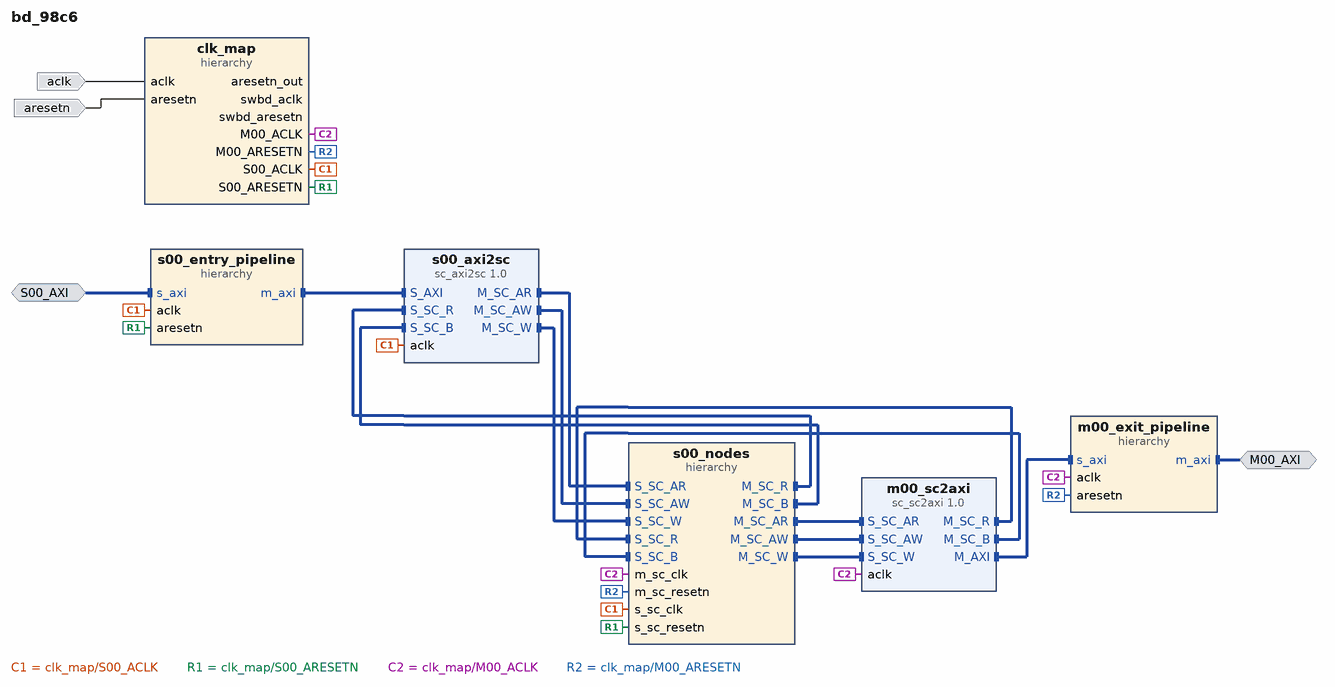
[diagram p0: block diagram of the top level]
# Vivado block design bd_98c6, xc7z020clg484-1, Vivado 2018.2
create_bd_design bd_98c6

create_bd_intf_port -mode Slave -vlnv xilinx.com:interface:aximm_rtl:1.0 S00_AXI
create_bd_intf_port -mode Master -vlnv xilinx.com:interface:aximm_rtl:1.0 M00_AXI
set_property -dict [list \
  CONFIG.SUPPORTS_NARROW_BURST 0 \
  CONFIG.MAX_BURST_LENGTH 16 \
  CONFIG.RUSER_BITS_PER_BYTE 0 \
  CONFIG.WUSER_BITS_PER_BYTE 0 \
] [get_bd_intf_ports M00_AXI]
create_bd_port -dir I -type clk aclk
set_property -dict {CONFIG.ASSOCIATED_BUSIF M00_AXI:S00_AXI} [get_bd_ports aclk]
create_bd_port -dir I -type rst aresetn
set_property -dict {CONFIG.POLARITY ACTIVE_LOW} [get_bd_ports aresetn]

create_bd_cell -type hier clk_map
create_bd_cell -type hier s00_entry_pipeline
create_bd_cell -type ip -vlnv xilinx.com:ip:sc_axi2sc:1.0 s00_axi2sc
set_property -dict [list \
  CONFIG.READ_WRITE_MODE READ_WRITE \
  CONFIG.AXI_ADDR_WIDTH 32 \
  CONFIG.AXI_ID_WIDTH 1 \
  CONFIG.AXI_RDATA_WIDTH 32 \
  CONFIG.AXI_WDATA_WIDTH 32 \
  CONFIG.SC_ADDR_WIDTH 32 \
  CONFIG.SC_ID_WIDTH 1 \
  CONFIG.SC_RDATA_WIDTH 64 \
  CONFIG.SC_WDATA_WIDTH 64 \
  CONFIG.SC_ARUSER_WIDTH 0 \
  CONFIG.SC_AWUSER_WIDTH 0 \
  CONFIG.SC_BUSER_WIDTH 0 \
  CONFIG.SC_WUSER_BITS_PER_BYTE 0 \
  CONFIG.SC_RUSER_BITS_PER_BYTE 0 \
  CONFIG.MSC_ROUTE_WIDTH 1 \
  CONFIG.SSC_ROUTE_WIDTH 1 \
] [get_bd_cells s00_axi2sc]
create_bd_cell -type hier s00_nodes
create_bd_cell -type ip -vlnv xilinx.com:ip:sc_sc2axi:1.0 m00_sc2axi
set_property -dict [list \
  CONFIG.READ_WRITE_MODE READ_WRITE \
  CONFIG.AXI_ADDR_WIDTH 32 \
  CONFIG.AXI_ID_WIDTH 1 \
  CONFIG.AXI_RDATA_WIDTH 64 \
  CONFIG.AXI_WDATA_WIDTH 64 \
  CONFIG.SC_ADDR_WIDTH 32 \
  CONFIG.SC_ID_WIDTH 1 \
  CONFIG.SC_RDATA_WIDTH 64 \
  CONFIG.SC_WDATA_WIDTH 64 \
  CONFIG.SC_ARUSER_WIDTH 0 \
  CONFIG.SC_AWUSER_WIDTH 0 \
  CONFIG.SC_BUSER_WIDTH 0 \
  CONFIG.SC_WUSER_BITS_PER_BYTE 0 \
  CONFIG.SC_RUSER_BITS_PER_BYTE 0 \
  CONFIG.MSC_ROUTE_WIDTH 1 \
  CONFIG.SSC_ROUTE_WIDTH 1 \
] [get_bd_cells m00_sc2axi]
create_bd_cell -type hier m00_exit_pipeline

# ---- hierarchy /clk_map ----
current_bd_instance /clk_map
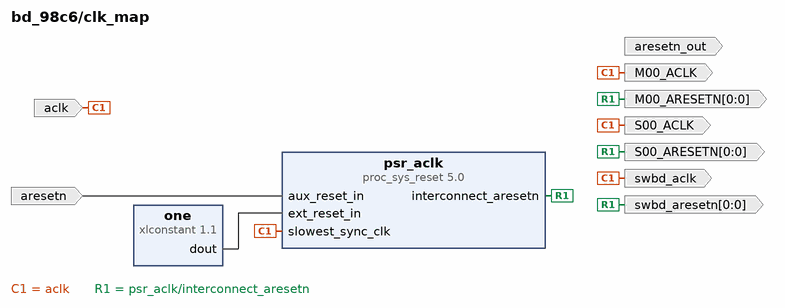
[diagram p1: block diagram inside /clk_map]
create_bd_pin -dir O -type clk S00_ACLK
create_bd_pin -dir O -from 0 -to 0 -type rst S00_ARESETN
create_bd_pin -dir O -type clk M00_ACLK
create_bd_pin -dir O -from 0 -to 0 -type rst M00_ARESETN
create_bd_pin -dir O -type clk swbd_aclk
create_bd_pin -dir O -from 0 -to 0 -type rst swbd_aresetn
create_bd_pin -dir I -type rst aresetn
create_bd_pin -dir O -type rst aresetn_out
create_bd_pin -dir I -type clk aclk

create_bd_cell -type ip -vlnv xilinx.com:ip:xlconstant:1.1 one
create_bd_cell -type ip -vlnv xilinx.com:ip:proc_sys_reset:5.0 psr_aclk
set_property -dict {CONFIG.C_AUX_RESET_HIGH 0 CONFIG.C_AUX_RST_WIDTH 1} [get_bd_cells psr_aclk]

# ---- hierarchy /s00_entry_pipeline ----
current_bd_instance /s00_entry_pipeline
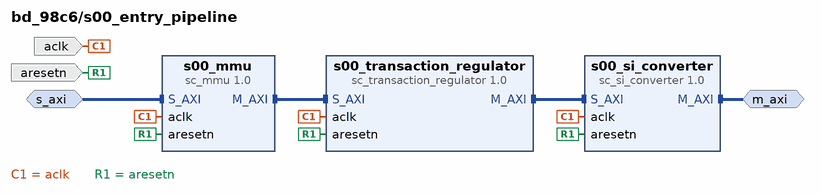
[diagram p2: block diagram inside /s00_entry_pipeline]
create_bd_intf_pin -mode Slave -vlnv xilinx.com:interface:aximm_rtl:1.0 s_axi
create_bd_intf_pin -mode Master -vlnv xilinx.com:interface:aximm_rtl:1.0 m_axi
create_bd_pin -dir I -type clk aclk
create_bd_pin -dir I -type rst aresetn

create_bd_cell -type ip -vlnv xilinx.com:ip:sc_mmu:1.0 s00_mmu
set_property -dict [list \
  CONFIG.IS_CASCADED 0 \
  CONFIG.NUM_SEG 1 \
  CONFIG.MSC_ROUTE_WIDTH 1 \
  CONFIG.NUM_MSC 1 \
  CONFIG.ADDR_WIDTH 32 \
  CONFIG.ID_WIDTH 1 \
  CONFIG.RDATA_WIDTH 32 \
  CONFIG.WDATA_WIDTH 32 \
  CONFIG.S_ARUSER_WIDTH 0 \
  CONFIG.S_AWUSER_WIDTH 0 \
  CONFIG.S_RUSER_WIDTH 0 \
  CONFIG.S_WUSER_WIDTH 0 \
  CONFIG.S_BUSER_WIDTH 0 \
  CONFIG.S_PROTOCOL AXI4 \
  CONFIG.READ_WRITE_MODE READ_WRITE \
  CONFIG.SEG000_BASE_ADDR 0x0000000000000000 \
  CONFIG.SEG000_SIZE 29 \
  CONFIG.SEG000_SEP_ROUTE 0b0000000000000000000000000000000000000000000000000000000000000000 \
  CONFIG.SEG000_SUPPORTS_READ 1 \
  CONFIG.SEG000_SUPPORTS_WRITE 1 \
  CONFIG.SEG000_SECURE_READ 0 \
  CONFIG.SEG000_SECURE_WRITE 0 \
  CONFIG.MSC000_ROUTE 0b1 \
] [get_bd_cells s00_mmu]
create_bd_cell -type ip -vlnv xilinx.com:ip:sc_transaction_regulator:1.0 s00_transaction_regulator
set_property -dict [list \
  CONFIG.READ_WRITE_MODE READ_WRITE \
  CONFIG.IS_CASCADED 0 \
  CONFIG.MEP_IDENTIFIER 0 \
  CONFIG.MEP_IDENTIFIER_WIDTH 1 \
  CONFIG.ADDR_WIDTH 32 \
  CONFIG.S_ID_WIDTH 1 \
  CONFIG.WDATA_WIDTH 32 \
  CONFIG.RDATA_WIDTH 32 \
  CONFIG.SEP_ROUTE_WIDTH 1 \
  CONFIG.SUPPORTS_READ_DEADLOCK 0 \
  CONFIG.SUPPORTS_WRITE_DEADLOCK 0 \
] [get_bd_cells s00_transaction_regulator]
create_bd_cell -type ip -vlnv xilinx.com:ip:sc_si_converter:1.0 s00_si_converter
set_property -dict [list \
  CONFIG.READ_WRITE_MODE READ_WRITE \
  CONFIG.LIMIT_READ_LENGTH 0 \
  CONFIG.LIMIT_WRITE_LENGTH 0 \
  CONFIG.IS_CASCADED 0 \
  CONFIG.NUM_READ_THREADS 1 \
  CONFIG.NUM_WRITE_THREADS 1 \
  CONFIG.MEP_IDENTIFIER_WIDTH 1 \
  CONFIG.SUPPORTS_NARROW 0 \
  CONFIG.HAS_BURST 1 \
  CONFIG.NUM_SEG 1 \
  CONFIG.ADDR_WIDTH 32 \
  CONFIG.ID_WIDTH 1 \
  CONFIG.RDATA_WIDTH 32 \
  CONFIG.WDATA_WIDTH 32 \
  CONFIG.NUM_MSC 1 \
  CONFIG.S_RUSER_BITS_PER_BYTE 0 \
  CONFIG.S_WUSER_BITS_PER_BYTE 0 \
  CONFIG.MAX_RUSER_BITS_PER_BYTE 0 \
  CONFIG.MAX_WUSER_BITS_PER_BYTE 0 \
  CONFIG.SEP000_RDATA_WIDTH 64 \
  CONFIG.SEP000_WDATA_WIDTH 64 \
  CONFIG.SEP000_PROTOCOL AXI3 \
  CONFIG.MSC000_RDATA_WIDTH 64 \
  CONFIG.MSC000_WDATA_WIDTH 64 \
] [get_bd_cells s00_si_converter]

# ---- hierarchy /s00_nodes ----
current_bd_instance /s00_nodes
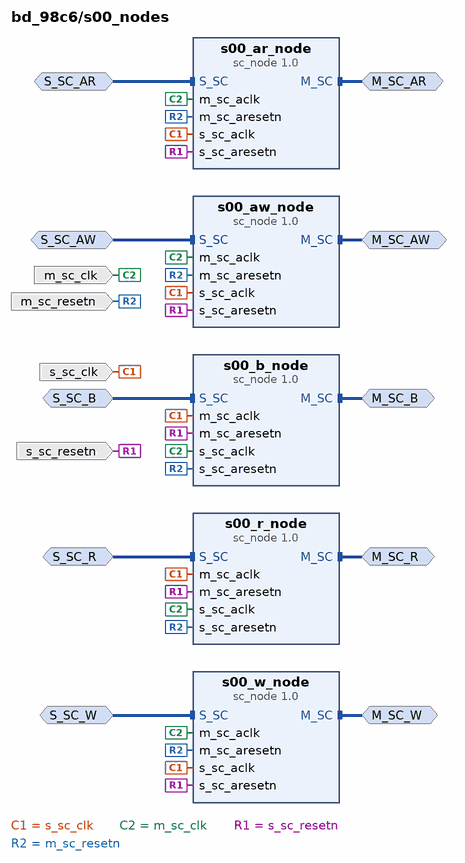
[diagram p3: block diagram inside /s00_nodes]
create_bd_intf_pin -mode Master -vlnv xilinx.com:interface:sc_rtl:1.0 M_SC_AR
create_bd_intf_pin -mode Slave -vlnv xilinx.com:interface:sc_rtl:1.0 S_SC_AR
create_bd_intf_pin -mode Master -vlnv xilinx.com:interface:sc_rtl:1.0 M_SC_R
create_bd_intf_pin -mode Slave -vlnv xilinx.com:interface:sc_rtl:1.0 S_SC_R
create_bd_intf_pin -mode Master -vlnv xilinx.com:interface:sc_rtl:1.0 M_SC_AW
create_bd_intf_pin -mode Slave -vlnv xilinx.com:interface:sc_rtl:1.0 S_SC_AW
create_bd_intf_pin -mode Master -vlnv xilinx.com:interface:sc_rtl:1.0 M_SC_W
create_bd_intf_pin -mode Slave -vlnv xilinx.com:interface:sc_rtl:1.0 S_SC_W
create_bd_intf_pin -mode Master -vlnv xilinx.com:interface:sc_rtl:1.0 M_SC_B
create_bd_intf_pin -mode Slave -vlnv xilinx.com:interface:sc_rtl:1.0 S_SC_B
create_bd_pin -dir I -type clk s_sc_clk
create_bd_pin -dir I -type rst s_sc_resetn
create_bd_pin -dir I -type clk m_sc_clk
create_bd_pin -dir I -type rst m_sc_resetn

create_bd_cell -type ip -vlnv xilinx.com:ip:sc_node:1.0 s00_ar_node
set_property -dict [list \
  CONFIG.NUM_SI 1 \
  CONFIG.NUM_MI 1 \
  CONFIG.CHANNEL 2 \
  CONFIG.MAX_PAYLD_BYTES 8 \
  CONFIG.SC_ROUTE_WIDTH 1 \
  CONFIG.ID_WIDTH 1 \
  CONFIG.PAYLD_WIDTH 138 \
  CONFIG.ADDR_WIDTH 32 \
  CONFIG.USER_WIDTH 0 \
  CONFIG.M_SEND_PIPELINE 0 \
  CONFIG.ACLK_RELATIONSHIP 1 \
  CONFIG.ACLKEN_CONVERSION 0 \
  CONFIG.S00_NUM_BYTES 4 \
  CONFIG.S01_NUM_BYTES 4 \
  CONFIG.S02_NUM_BYTES 4 \
  CONFIG.S03_NUM_BYTES 4 \
  CONFIG.S04_NUM_BYTES 4 \
  CONFIG.S05_NUM_BYTES 4 \
  CONFIG.S06_NUM_BYTES 4 \
  CONFIG.S07_NUM_BYTES 4 \
  CONFIG.S08_NUM_BYTES 4 \
  CONFIG.S09_NUM_BYTES 4 \
  CONFIG.S10_NUM_BYTES 4 \
  CONFIG.S11_NUM_BYTES 4 \
  CONFIG.S12_NUM_BYTES 4 \
  CONFIG.S13_NUM_BYTES 4 \
  CONFIG.S14_NUM_BYTES 4 \
  CONFIG.S15_NUM_BYTES 4 \
  CONFIG.M00_NUM_BYTES 8 \
  CONFIG.M01_NUM_BYTES 8 \
  CONFIG.M02_NUM_BYTES 8 \
  CONFIG.M03_NUM_BYTES 8 \
  CONFIG.M04_NUM_BYTES 8 \
  CONFIG.M05_NUM_BYTES 8 \
  CONFIG.M06_NUM_BYTES 8 \
  CONFIG.M07_NUM_BYTES 8 \
  CONFIG.M08_NUM_BYTES 8 \
  CONFIG.M09_NUM_BYTES 8 \
  CONFIG.M10_NUM_BYTES 8 \
  CONFIG.M11_NUM_BYTES 8 \
  CONFIG.M12_NUM_BYTES 8 \
  CONFIG.M13_NUM_BYTES 8 \
  CONFIG.M14_NUM_BYTES 8 \
  CONFIG.M15_NUM_BYTES 8 \
] [get_bd_cells s00_ar_node]
create_bd_cell -type ip -vlnv xilinx.com:ip:sc_node:1.0 s00_r_node
set_property -dict [list \
  CONFIG.NUM_SI 1 \
  CONFIG.NUM_MI 1 \
  CONFIG.CHANNEL 0 \
  CONFIG.USER_BITS_PER_BYTE 0 \
  CONFIG.MAX_PAYLD_BYTES 8 \
  CONFIG.SC_ROUTE_WIDTH 1 \
  CONFIG.ID_WIDTH 1 \
  CONFIG.PAYLD_WIDTH 83 \
  CONFIG.ADDR_WIDTH 32 \
  CONFIG.M_SEND_PIPELINE 0 \
  CONFIG.ACLK_RELATIONSHIP 1 \
  CONFIG.ACLKEN_CONVERSION 0 \
  CONFIG.S00_NUM_BYTES 8 \
  CONFIG.S01_NUM_BYTES 8 \
  CONFIG.S02_NUM_BYTES 8 \
  CONFIG.S03_NUM_BYTES 8 \
  CONFIG.S04_NUM_BYTES 8 \
  CONFIG.S05_NUM_BYTES 8 \
  CONFIG.S06_NUM_BYTES 8 \
  CONFIG.S07_NUM_BYTES 8 \
  CONFIG.S08_NUM_BYTES 8 \
  CONFIG.S09_NUM_BYTES 8 \
  CONFIG.S10_NUM_BYTES 8 \
  CONFIG.S11_NUM_BYTES 8 \
  CONFIG.S12_NUM_BYTES 8 \
  CONFIG.S13_NUM_BYTES 8 \
  CONFIG.S14_NUM_BYTES 8 \
  CONFIG.S15_NUM_BYTES 8 \
  CONFIG.M00_NUM_BYTES 4 \
  CONFIG.M01_NUM_BYTES 4 \
  CONFIG.M02_NUM_BYTES 4 \
  CONFIG.M03_NUM_BYTES 4 \
  CONFIG.M04_NUM_BYTES 4 \
  CONFIG.M05_NUM_BYTES 4 \
  CONFIG.M06_NUM_BYTES 4 \
  CONFIG.M07_NUM_BYTES 4 \
  CONFIG.M08_NUM_BYTES 4 \
  CONFIG.M09_NUM_BYTES 4 \
  CONFIG.M10_NUM_BYTES 4 \
  CONFIG.M11_NUM_BYTES 4 \
  CONFIG.M12_NUM_BYTES 4 \
  CONFIG.M13_NUM_BYTES 4 \
  CONFIG.M14_NUM_BYTES 4 \
  CONFIG.M15_NUM_BYTES 4 \
] [get_bd_cells s00_r_node]
create_bd_cell -type ip -vlnv xilinx.com:ip:sc_node:1.0 s00_aw_node
set_property -dict [list \
  CONFIG.NUM_SI 1 \
  CONFIG.NUM_MI 1 \
  CONFIG.CHANNEL 3 \
  CONFIG.MAX_PAYLD_BYTES 8 \
  CONFIG.SC_ROUTE_WIDTH 1 \
  CONFIG.ID_WIDTH 1 \
  CONFIG.PAYLD_WIDTH 138 \
  CONFIG.ADDR_WIDTH 32 \
  CONFIG.USER_WIDTH 0 \
  CONFIG.M_SEND_PIPELINE 0 \
  CONFIG.ACLK_RELATIONSHIP 1 \
  CONFIG.ACLKEN_CONVERSION 0 \
  CONFIG.S00_NUM_BYTES 4 \
  CONFIG.S01_NUM_BYTES 4 \
  CONFIG.S02_NUM_BYTES 4 \
  CONFIG.S03_NUM_BYTES 4 \
  CONFIG.S04_NUM_BYTES 4 \
  CONFIG.S05_NUM_BYTES 4 \
  CONFIG.S06_NUM_BYTES 4 \
  CONFIG.S07_NUM_BYTES 4 \
  CONFIG.S08_NUM_BYTES 4 \
  CONFIG.S09_NUM_BYTES 4 \
  CONFIG.S10_NUM_BYTES 4 \
  CONFIG.S11_NUM_BYTES 4 \
  CONFIG.S12_NUM_BYTES 4 \
  CONFIG.S13_NUM_BYTES 4 \
  CONFIG.S14_NUM_BYTES 4 \
  CONFIG.S15_NUM_BYTES 4 \
  CONFIG.M00_NUM_BYTES 8 \
  CONFIG.M01_NUM_BYTES 8 \
  CONFIG.M02_NUM_BYTES 8 \
  CONFIG.M03_NUM_BYTES 8 \
  CONFIG.M04_NUM_BYTES 8 \
  CONFIG.M05_NUM_BYTES 8 \
  CONFIG.M06_NUM_BYTES 8 \
  CONFIG.M07_NUM_BYTES 8 \
  CONFIG.M08_NUM_BYTES 8 \
  CONFIG.M09_NUM_BYTES 8 \
  CONFIG.M10_NUM_BYTES 8 \
  CONFIG.M11_NUM_BYTES 8 \
  CONFIG.M12_NUM_BYTES 8 \
  CONFIG.M13_NUM_BYTES 8 \
  CONFIG.M14_NUM_BYTES 8 \
  CONFIG.M15_NUM_BYTES 8 \
] [get_bd_cells s00_aw_node]
create_bd_cell -type ip -vlnv xilinx.com:ip:sc_node:1.0 s00_w_node
set_property -dict [list \
  CONFIG.NUM_SI 1 \
  CONFIG.NUM_MI 1 \
  CONFIG.CHANNEL 1 \
  CONFIG.USER_BITS_PER_BYTE 0 \
  CONFIG.MAX_PAYLD_BYTES 8 \
  CONFIG.SC_ROUTE_WIDTH 1 \
  CONFIG.ID_WIDTH 1 \
  CONFIG.PAYLD_WIDTH 88 \
  CONFIG.ADDR_WIDTH 32 \
  CONFIG.M_SEND_PIPELINE 0 \
  CONFIG.ACLK_RELATIONSHIP 1 \
  CONFIG.ACLKEN_CONVERSION 0 \
  CONFIG.S00_NUM_BYTES 4 \
  CONFIG.S01_NUM_BYTES 4 \
  CONFIG.S02_NUM_BYTES 4 \
  CONFIG.S03_NUM_BYTES 4 \
  CONFIG.S04_NUM_BYTES 4 \
  CONFIG.S05_NUM_BYTES 4 \
  CONFIG.S06_NUM_BYTES 4 \
  CONFIG.S07_NUM_BYTES 4 \
  CONFIG.S08_NUM_BYTES 4 \
  CONFIG.S09_NUM_BYTES 4 \
  CONFIG.S10_NUM_BYTES 4 \
  CONFIG.S11_NUM_BYTES 4 \
  CONFIG.S12_NUM_BYTES 4 \
  CONFIG.S13_NUM_BYTES 4 \
  CONFIG.S14_NUM_BYTES 4 \
  CONFIG.S15_NUM_BYTES 4 \
  CONFIG.M00_NUM_BYTES 8 \
  CONFIG.M01_NUM_BYTES 8 \
  CONFIG.M02_NUM_BYTES 8 \
  CONFIG.M03_NUM_BYTES 8 \
  CONFIG.M04_NUM_BYTES 8 \
  CONFIG.M05_NUM_BYTES 8 \
  CONFIG.M06_NUM_BYTES 8 \
  CONFIG.M07_NUM_BYTES 8 \
  CONFIG.M08_NUM_BYTES 8 \
  CONFIG.M09_NUM_BYTES 8 \
  CONFIG.M10_NUM_BYTES 8 \
  CONFIG.M11_NUM_BYTES 8 \
  CONFIG.M12_NUM_BYTES 8 \
  CONFIG.M13_NUM_BYTES 8 \
  CONFIG.M14_NUM_BYTES 8 \
  CONFIG.M15_NUM_BYTES 8 \
] [get_bd_cells s00_w_node]
create_bd_cell -type ip -vlnv xilinx.com:ip:sc_node:1.0 s00_b_node
set_property -dict [list \
  CONFIG.NUM_SI 1 \
  CONFIG.NUM_MI 1 \
  CONFIG.CHANNEL 4 \
  CONFIG.MAX_PAYLD_BYTES 8 \
  CONFIG.SC_ROUTE_WIDTH 1 \
  CONFIG.ID_WIDTH 1 \
  CONFIG.PAYLD_WIDTH 5 \
  CONFIG.ADDR_WIDTH 32 \
  CONFIG.USER_WIDTH 0 \
  CONFIG.M_SEND_PIPELINE 0 \
  CONFIG.ACLK_RELATIONSHIP 1 \
  CONFIG.ACLKEN_CONVERSION 0 \
  CONFIG.S00_NUM_BYTES 8 \
  CONFIG.S01_NUM_BYTES 8 \
  CONFIG.S02_NUM_BYTES 8 \
  CONFIG.S03_NUM_BYTES 8 \
  CONFIG.S04_NUM_BYTES 8 \
  CONFIG.S05_NUM_BYTES 8 \
  CONFIG.S06_NUM_BYTES 8 \
  CONFIG.S07_NUM_BYTES 8 \
  CONFIG.S08_NUM_BYTES 8 \
  CONFIG.S09_NUM_BYTES 8 \
  CONFIG.S10_NUM_BYTES 8 \
  CONFIG.S11_NUM_BYTES 8 \
  CONFIG.S12_NUM_BYTES 8 \
  CONFIG.S13_NUM_BYTES 8 \
  CONFIG.S14_NUM_BYTES 8 \
  CONFIG.S15_NUM_BYTES 8 \
  CONFIG.M00_NUM_BYTES 4 \
  CONFIG.M01_NUM_BYTES 4 \
  CONFIG.M02_NUM_BYTES 4 \
  CONFIG.M03_NUM_BYTES 4 \
  CONFIG.M04_NUM_BYTES 4 \
  CONFIG.M05_NUM_BYTES 4 \
  CONFIG.M06_NUM_BYTES 4 \
  CONFIG.M07_NUM_BYTES 4 \
  CONFIG.M08_NUM_BYTES 4 \
  CONFIG.M09_NUM_BYTES 4 \
  CONFIG.M10_NUM_BYTES 4 \
  CONFIG.M11_NUM_BYTES 4 \
  CONFIG.M12_NUM_BYTES 4 \
  CONFIG.M13_NUM_BYTES 4 \
  CONFIG.M14_NUM_BYTES 4 \
  CONFIG.M15_NUM_BYTES 4 \
] [get_bd_cells s00_b_node]

# ---- hierarchy /m00_exit_pipeline ----
current_bd_instance /m00_exit_pipeline
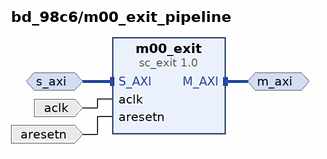
[diagram p4: block diagram inside /m00_exit_pipeline]
create_bd_intf_pin -mode Slave -vlnv xilinx.com:interface:aximm_rtl:1.0 s_axi
create_bd_intf_pin -mode Master -vlnv xilinx.com:interface:aximm_rtl:1.0 m_axi
create_bd_pin -dir I -type clk aclk
create_bd_pin -dir I -type rst aresetn

create_bd_cell -type ip -vlnv xilinx.com:ip:sc_exit:1.0 m00_exit
set_property -dict [list \
  CONFIG.READ_WRITE_MODE READ_WRITE \
  CONFIG.IS_CASCADED 0 \
  CONFIG.SSC_ROUTE_WIDTH 1 \
  CONFIG.MEP_IDENTIFIER_WIDTH 1 \
  CONFIG.RDATA_WIDTH 64 \
  CONFIG.WDATA_WIDTH 64 \
  CONFIG.M_RUSER_BITS_PER_BYTE 0 \
  CONFIG.M_WUSER_BITS_PER_BYTE 0 \
  CONFIG.MAX_RUSER_BITS_PER_BYTE 0 \
  CONFIG.MAX_WUSER_BITS_PER_BYTE 0 \
  CONFIG.M_ARUSER_WIDTH 0 \
  CONFIG.M_AWUSER_WIDTH 0 \
  CONFIG.M_RUSER_WIDTH 0 \
  CONFIG.M_WUSER_WIDTH 0 \
  CONFIG.M_BUSER_WIDTH 0 \
  CONFIG.S_ID_WIDTH 1 \
  CONFIG.M_ID_WIDTH 0 \
  CONFIG.M_MAX_BURST_LENGTH 16 \
  CONFIG.ADDR_WIDTH 32 \
  CONFIG.M_PROTOCOL AXI3 \
  CONFIG.HAS_LOCK 0 \
  CONFIG.HAS_BURST 1 \
  CONFIG.NUM_MSC 1 \
  CONFIG.SSC000_ROUTE 0b1 \
  CONFIG.SSC001_ROUTE 0b0 \
] [get_bd_cells m00_exit]

# ---- connections ----

current_bd_instance /clk_map
connect_bd_net -net clk_map_aresetn_net [get_bd_pins aresetn] [get_bd_pins psr_aclk/aux_reset_in]
connect_bd_net -net clk_map_aclk_net [get_bd_pins aclk] \
  [get_bd_pins S00_ACLK] [get_bd_pins M00_ACLK] [get_bd_pins swbd_aclk] [get_bd_pins psr_aclk/slowest_sync_clk]
connect_bd_net [get_bd_pins psr_aclk/interconnect_aresetn] [get_bd_pins S00_ARESETN] [get_bd_pins M00_ARESETN] [get_bd_pins swbd_aresetn]
connect_bd_net [get_bd_pins one/dout] [get_bd_pins psr_aclk/ext_reset_in]

current_bd_instance /s00_entry_pipeline
connect_bd_intf_net [get_bd_intf_pins s00_mmu/M_AXI] [get_bd_intf_pins s00_transaction_regulator/S_AXI]
connect_bd_intf_net [get_bd_intf_pins s00_transaction_regulator/M_AXI] [get_bd_intf_pins s00_si_converter/S_AXI]
connect_bd_intf_net [get_bd_intf_pins s_axi] [get_bd_intf_pins s00_mmu/S_AXI]
connect_bd_intf_net [get_bd_intf_pins m_axi] [get_bd_intf_pins s00_si_converter/M_AXI]
connect_bd_net [get_bd_pins aclk] [get_bd_pins s00_mmu/aclk] [get_bd_pins s00_si_converter/aclk] [get_bd_pins s00_transaction_regulator/aclk]
connect_bd_net [get_bd_pins aresetn] \
  [get_bd_pins s00_mmu/aresetn] [get_bd_pins s00_si_converter/aresetn] [get_bd_pins s00_transaction_regulator/aresetn]

current_bd_instance /s00_nodes
connect_bd_intf_net [get_bd_intf_pins M_SC_AR] [get_bd_intf_pins s00_ar_node/M_SC]
connect_bd_intf_net [get_bd_intf_pins S_SC_AR] [get_bd_intf_pins s00_ar_node/S_SC]
connect_bd_intf_net [get_bd_intf_pins M_SC_R] [get_bd_intf_pins s00_r_node/M_SC]
connect_bd_intf_net [get_bd_intf_pins S_SC_R] [get_bd_intf_pins s00_r_node/S_SC]
connect_bd_intf_net [get_bd_intf_pins M_SC_AW] [get_bd_intf_pins s00_aw_node/M_SC]
connect_bd_intf_net [get_bd_intf_pins S_SC_AW] [get_bd_intf_pins s00_aw_node/S_SC]
connect_bd_intf_net [get_bd_intf_pins M_SC_W] [get_bd_intf_pins s00_w_node/M_SC]
connect_bd_intf_net [get_bd_intf_pins S_SC_W] [get_bd_intf_pins s00_w_node/S_SC]
connect_bd_intf_net [get_bd_intf_pins M_SC_B] [get_bd_intf_pins s00_b_node/M_SC]
connect_bd_intf_net [get_bd_intf_pins S_SC_B] [get_bd_intf_pins s00_b_node/S_SC]
connect_bd_net [get_bd_pins s_sc_clk] \
  [get_bd_pins s00_ar_node/s_sc_aclk] [get_bd_pins s00_aw_node/s_sc_aclk] [get_bd_pins s00_w_node/s_sc_aclk] \
  [get_bd_pins s00_r_node/m_sc_aclk] [get_bd_pins s00_b_node/m_sc_aclk]
connect_bd_net [get_bd_pins m_sc_clk] \
  [get_bd_pins s00_ar_node/m_sc_aclk] [get_bd_pins s00_aw_node/m_sc_aclk] [get_bd_pins s00_w_node/m_sc_aclk] \
  [get_bd_pins s00_r_node/s_sc_aclk] [get_bd_pins s00_b_node/s_sc_aclk]
connect_bd_net [get_bd_pins s_sc_resetn] \
  [get_bd_pins s00_ar_node/s_sc_aresetn] [get_bd_pins s00_aw_node/s_sc_aresetn] [get_bd_pins s00_w_node/s_sc_aresetn] \
  [get_bd_pins s00_r_node/m_sc_aresetn] [get_bd_pins s00_b_node/m_sc_aresetn]
connect_bd_net [get_bd_pins m_sc_resetn] \
  [get_bd_pins s00_ar_node/m_sc_aresetn] [get_bd_pins s00_aw_node/m_sc_aresetn] [get_bd_pins s00_w_node/m_sc_aresetn] \
  [get_bd_pins s00_r_node/s_sc_aresetn] [get_bd_pins s00_b_node/s_sc_aresetn]

current_bd_instance /m00_exit_pipeline
connect_bd_intf_net [get_bd_intf_pins s_axi] [get_bd_intf_pins m00_exit/S_AXI]
connect_bd_intf_net [get_bd_intf_pins m_axi] [get_bd_intf_pins m00_exit/M_AXI]
connect_bd_net [get_bd_pins aclk] [get_bd_pins m00_exit/aclk]
connect_bd_net [get_bd_pins aresetn] [get_bd_pins m00_exit/aresetn]

current_bd_instance /
connect_bd_intf_net [get_bd_intf_pins s00_entry_pipeline/m_axi] [get_bd_intf_pins s00_axi2sc/S_AXI]
connect_bd_intf_net [get_bd_intf_pins s00_nodes/S_SC_AR] [get_bd_intf_pins s00_axi2sc/M_SC_AR]
connect_bd_intf_net [get_bd_intf_pins s00_nodes/S_SC_AW] [get_bd_intf_pins s00_axi2sc/M_SC_AW]
connect_bd_intf_net [get_bd_intf_pins s00_nodes/S_SC_W] [get_bd_intf_pins s00_axi2sc/M_SC_W]
connect_bd_intf_net [get_bd_intf_pins s00_nodes/M_SC_R] [get_bd_intf_pins s00_axi2sc/S_SC_R]
connect_bd_intf_net [get_bd_intf_pins s00_nodes/M_SC_B] [get_bd_intf_pins s00_axi2sc/S_SC_B]
connect_bd_intf_net [get_bd_intf_pins m00_sc2axi/M_AXI] [get_bd_intf_pins m00_exit_pipeline/s_axi]
connect_bd_intf_net [get_bd_intf_pins s00_nodes/M_SC_AR] [get_bd_intf_pins m00_sc2axi/S_SC_AR]
connect_bd_intf_net [get_bd_intf_pins s00_nodes/M_SC_AW] [get_bd_intf_pins m00_sc2axi/S_SC_AW]
connect_bd_intf_net [get_bd_intf_pins s00_nodes/M_SC_W] [get_bd_intf_pins m00_sc2axi/S_SC_W]
connect_bd_intf_net [get_bd_intf_pins s00_nodes/S_SC_R] [get_bd_intf_pins m00_sc2axi/M_SC_R]
connect_bd_intf_net [get_bd_intf_pins s00_nodes/S_SC_B] [get_bd_intf_pins m00_sc2axi/M_SC_B]
connect_bd_intf_net [get_bd_intf_ports S00_AXI] [get_bd_intf_pins s00_entry_pipeline/s_axi]
connect_bd_intf_net [get_bd_intf_ports M00_AXI] [get_bd_intf_pins m00_exit_pipeline/m_axi]
connect_bd_net -net aclk_net [get_bd_ports aclk] [get_bd_pins clk_map/aclk]
connect_bd_net [get_bd_ports aresetn] [get_bd_pins clk_map/aresetn]
# net aresetn_net has one end: clk_map/aresetn_out
# net swbd_aclk_net has one end: clk_map/swbd_aclk
# net swbd_aresetn_net has one end: clk_map/swbd_aresetn
connect_bd_net -net aclk_1 [get_bd_pins clk_map/S00_ACLK] \
  [get_bd_pins s00_entry_pipeline/aclk] [get_bd_pins s00_axi2sc/aclk] [get_bd_pins s00_nodes/s_sc_clk]
connect_bd_net -net aresetn_2 [get_bd_pins clk_map/S00_ARESETN] [get_bd_pins s00_entry_pipeline/aresetn] [get_bd_pins s00_nodes/s_sc_resetn]
connect_bd_net -net m_sc_clk_1 [get_bd_pins clk_map/M00_ACLK] \
  [get_bd_pins s00_nodes/m_sc_clk] [get_bd_pins m00_sc2axi/aclk] [get_bd_pins m00_exit_pipeline/aclk]
connect_bd_net -net m_sc_resetn_1 [get_bd_pins clk_map/M00_ARESETN] [get_bd_pins s00_nodes/m_sc_resetn] [get_bd_pins m00_exit_pipeline/aresetn]

validate_bd_design
save_bd_design
